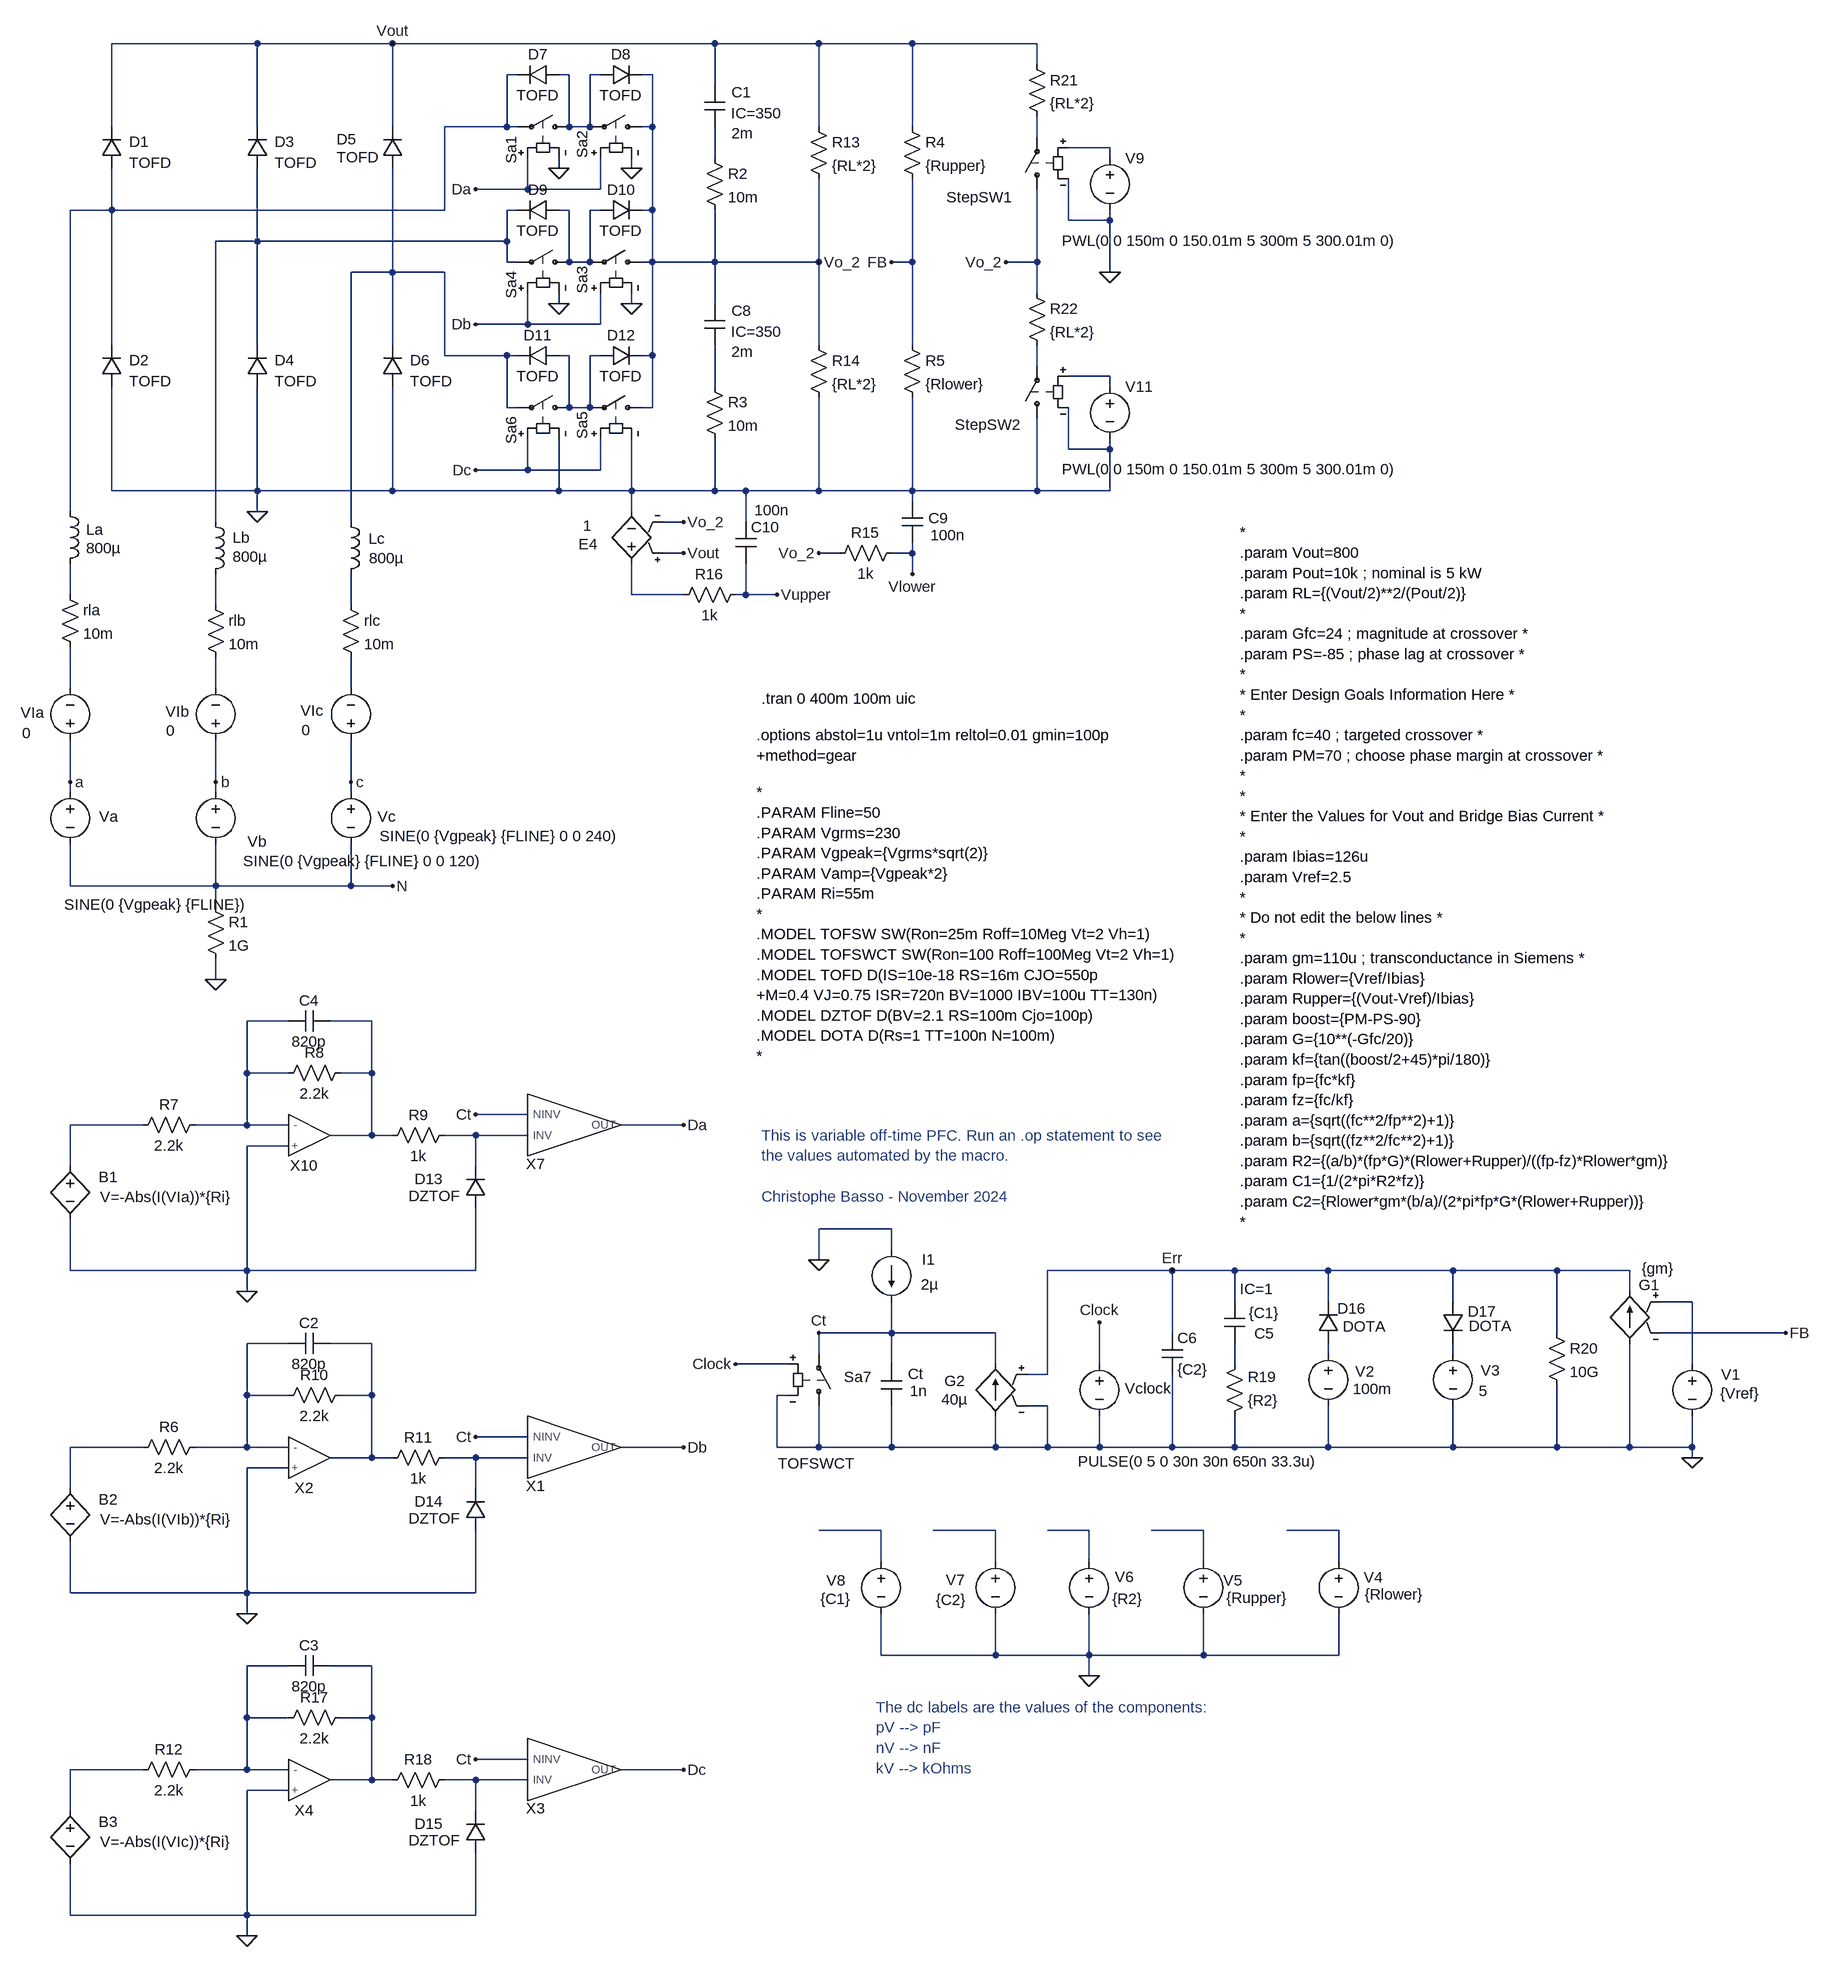
[diagram p0: schematic 3-phase Vienna PFC var Toff with switches - load step.asc]
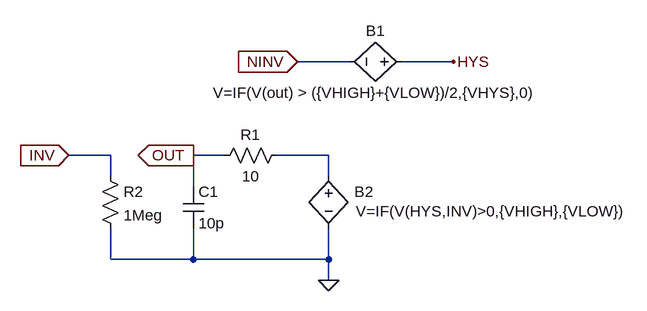
[diagram p1: sub-circuit comptof.asc]
3-phase Vienna PFC var Toff with switches - load step.asc, the LTspice schematic file:
Version 4
SHEET 1 4316 2068
WIRE 464 -960 240 -960
WIRE 672 -960 464 -960
WIRE 1168 -960 672 -960
WIRE 1328 -960 1168 -960
WIRE 1472 -960 1328 -960
WIRE 1664 -960 1472 -960
WIRE 1664 -928 1664 -960
WIRE 864 -912 848 -912
WIRE 944 -912 928 -912
WIRE 992 -912 976 -912
WIRE 1072 -912 1056 -912
WIRE 1168 -896 1168 -960
WIRE 240 -832 240 -960
WIRE 464 -832 464 -960
WIRE 672 -832 672 -960
WIRE 848 -832 848 -912
WIRE 848 -832 752 -832
WIRE 864 -832 848 -832
WIRE 944 -832 944 -912
WIRE 976 -832 976 -912
WIRE 976 -832 944 -832
WIRE 1072 -832 1072 -912
WIRE 1072 -832 1056 -832
WIRE 1328 -832 1328 -960
WIRE 1472 -832 1472 -960
WIRE 1664 -816 1664 -848
WIRE 1776 -800 1712 -800
WIRE 1168 -784 1168 -832
WIRE 1776 -784 1776 -800
WIRE 928 -768 928 -784
WIRE 1040 -768 1040 -784
WIRE 880 -736 880 -784
WIRE 880 -736 800 -736
WIRE 992 -736 992 -784
WIRE 992 -736 880 -736
WIRE 240 -704 240 -768
WIRE 240 -704 176 -704
WIRE 752 -704 752 -832
WIRE 752 -704 240 -704
WIRE 864 -704 848 -704
WIRE 944 -704 928 -704
WIRE 992 -704 976 -704
WIRE 1072 -704 1072 -832
WIRE 1072 -704 1056 -704
WIRE 1712 -688 1712 -752
WIRE 1776 -688 1776 -704
WIRE 1776 -688 1712 -688
WIRE 464 -656 464 -768
WIRE 464 -656 400 -656
WIRE 848 -656 848 -704
WIRE 848 -656 464 -656
WIRE 848 -624 848 -656
WIRE 864 -624 848 -624
WIRE 944 -624 944 -704
WIRE 976 -624 976 -704
WIRE 976 -624 944 -624
WIRE 1072 -624 1072 -704
WIRE 1072 -624 1056 -624
WIRE 1168 -624 1168 -704
WIRE 1168 -624 1072 -624
WIRE 1328 -624 1328 -752
WIRE 1328 -624 1168 -624
WIRE 1472 -624 1472 -752
WIRE 1472 -624 1440 -624
WIRE 1664 -624 1664 -736
WIRE 1664 -624 1616 -624
WIRE 672 -608 672 -768
WIRE 672 -608 608 -608
WIRE 752 -608 672 -608
WIRE 1776 -608 1776 -688
WIRE 1664 -576 1664 -624
WIRE 928 -560 928 -576
WIRE 1040 -560 1040 -576
WIRE 1168 -560 1168 -624
WIRE 880 -528 880 -576
WIRE 880 -528 800 -528
WIRE 992 -528 992 -576
WIRE 992 -528 880 -528
WIRE 240 -496 240 -704
WIRE 464 -496 464 -656
WIRE 672 -496 672 -608
WIRE 1328 -496 1328 -624
WIRE 1472 -496 1472 -624
WIRE 752 -480 752 -608
WIRE 848 -480 752 -480
WIRE 864 -480 848 -480
WIRE 944 -480 928 -480
WIRE 992 -480 976 -480
WIRE 1072 -480 1072 -624
WIRE 1072 -480 1056 -480
WIRE 1664 -464 1664 -496
WIRE 1776 -448 1712 -448
WIRE 1168 -432 1168 -496
WIRE 1776 -432 1776 -448
WIRE 848 -400 848 -480
WIRE 864 -400 848 -400
WIRE 944 -400 944 -480
WIRE 976 -400 976 -480
WIRE 976 -400 944 -400
WIRE 1072 -400 1072 -480
WIRE 1072 -400 1056 -400
WIRE 1712 -336 1712 -400
WIRE 1776 -336 1776 -352
WIRE 1776 -336 1712 -336
WIRE 880 -304 880 -352
WIRE 880 -304 800 -304
WIRE 992 -304 992 -352
WIRE 992 -304 880 -304
WIRE 240 -272 240 -432
WIRE 464 -272 464 -432
WIRE 464 -272 240 -272
WIRE 672 -272 672 -432
WIRE 672 -272 464 -272
WIRE 928 -272 928 -352
WIRE 928 -272 672 -272
WIRE 1040 -272 1040 -352
WIRE 1040 -272 928 -272
WIRE 1168 -272 1168 -352
WIRE 1168 -272 1040 -272
WIRE 1216 -272 1168 -272
WIRE 1328 -272 1328 -416
WIRE 1328 -272 1216 -272
WIRE 1472 -272 1472 -416
WIRE 1472 -272 1328 -272
WIRE 1664 -272 1664 -384
WIRE 1664 -272 1472 -272
WIRE 1776 -272 1776 -336
WIRE 1776 -272 1664 -272
WIRE 1472 -256 1472 -272
WIRE 176 -240 176 -704
WIRE 464 -240 464 -272
WIRE 1040 -240 1040 -272
WIRE 400 -224 400 -656
WIRE 608 -224 608 -608
WIRE 1120 -224 1088 -224
WIRE 1216 -224 1216 -272
WIRE 1120 -176 1088 -176
WIRE 1360 -176 1328 -176
WIRE 1472 -176 1472 -192
WIRE 1472 -176 1440 -176
WIRE 1472 -144 1472 -176
WIRE 176 -112 176 -160
WIRE 1040 -112 1040 -160
WIRE 1120 -112 1040 -112
WIRE 1216 -112 1216 -160
WIRE 1216 -112 1200 -112
WIRE 1264 -112 1216 -112
WIRE 400 -96 400 -144
WIRE 608 -96 608 -144
WIRE 176 32 176 -32
WIRE 400 32 400 -16
WIRE 608 32 608 -16
WIRE 176 176 176 112
WIRE 400 176 400 112
WIRE 608 176 608 112
WIRE 176 192 176 176
WIRE 400 192 400 176
WIRE 608 192 608 176
WIRE 176 336 176 272
WIRE 400 336 400 272
WIRE 400 336 176 336
WIRE 608 336 608 272
WIRE 608 336 400 336
WIRE 672 336 608 336
WIRE 400 368 400 336
WIRE 400 480 400 448
WIRE 512 544 448 544
WIRE 640 544 576 544
WIRE 448 624 448 544
WIRE 512 624 448 624
WIRE 640 624 640 544
WIRE 640 624 592 624
WIRE 880 688 800 688
WIRE 288 704 176 704
WIRE 448 704 448 624
WIRE 448 704 368 704
WIRE 512 704 448 704
WIRE 1120 704 1024 704
WIRE 640 720 640 624
WIRE 640 720 576 720
WIRE 672 720 640 720
WIRE 800 720 752 720
WIRE 880 720 800 720
WIRE 512 736 448 736
WIRE 176 768 176 704
WIRE 800 768 800 720
WIRE 1440 864 1328 864
WIRE 1440 896 1440 864
WIRE 1328 912 1328 864
WIRE 176 928 176 848
WIRE 448 928 448 736
WIRE 448 928 176 928
WIRE 800 928 800 832
WIRE 800 928 448 928
WIRE 1872 928 1680 928
WIRE 1968 928 1872 928
WIRE 2112 928 1968 928
WIRE 2304 928 2112 928
WIRE 2464 928 2304 928
WIRE 2576 928 2464 928
WIRE 448 960 448 928
WIRE 2576 960 2576 928
WIRE 1968 976 1968 928
WIRE 2112 976 2112 928
WIRE 2304 976 2304 928
WIRE 2672 976 2624 976
WIRE 1440 1024 1440 976
WIRE 1440 1024 1328 1024
WIRE 1600 1024 1440 1024
WIRE 1872 1024 1872 928
WIRE 2464 1024 2464 928
WIRE 2816 1024 2624 1024
WIRE 512 1040 448 1040
WIRE 640 1040 576 1040
WIRE 1328 1056 1328 1024
WIRE 2112 1056 2112 1040
WIRE 2304 1056 2304 1040
WIRE 1280 1072 1200 1072
WIRE 1440 1072 1440 1024
WIRE 1600 1072 1600 1024
WIRE 1760 1072 1760 1008
WIRE 1968 1072 1968 1040
WIRE 2672 1072 2672 976
WIRE 1680 1088 1680 928
WIRE 1680 1088 1648 1088
WIRE 448 1120 448 1040
WIRE 512 1120 448 1120
WIRE 640 1120 640 1040
WIRE 640 1120 592 1120
WIRE 1280 1120 1264 1120
WIRE 1680 1136 1648 1136
WIRE 880 1184 800 1184
WIRE 288 1200 176 1200
WIRE 448 1200 448 1120
WIRE 448 1200 368 1200
WIRE 512 1200 448 1200
WIRE 1120 1200 1024 1200
WIRE 1264 1200 1264 1120
WIRE 1328 1200 1328 1136
WIRE 1328 1200 1264 1200
WIRE 1440 1200 1440 1136
WIRE 1440 1200 1328 1200
WIRE 1600 1200 1600 1152
WIRE 1600 1200 1440 1200
WIRE 1680 1200 1680 1136
WIRE 1680 1200 1600 1200
WIRE 1760 1200 1760 1152
WIRE 1760 1200 1680 1200
WIRE 1872 1200 1872 1088
WIRE 1872 1200 1760 1200
WIRE 1968 1200 1968 1152
WIRE 1968 1200 1872 1200
WIRE 2112 1200 2112 1136
WIRE 2112 1200 1968 1200
WIRE 2304 1200 2304 1136
WIRE 2304 1200 2112 1200
WIRE 2464 1200 2464 1104
WIRE 2464 1200 2304 1200
WIRE 2576 1200 2576 1040
WIRE 2576 1200 2464 1200
WIRE 2672 1200 2672 1152
WIRE 2672 1200 2576 1200
WIRE 640 1216 640 1120
WIRE 640 1216 576 1216
WIRE 672 1216 640 1216
WIRE 800 1216 752 1216
WIRE 880 1216 800 1216
WIRE 2672 1216 2672 1200
WIRE 512 1232 448 1232
WIRE 176 1264 176 1200
WIRE 800 1264 800 1216
WIRE 1424 1328 1328 1328
WIRE 1600 1328 1504 1328
WIRE 1744 1328 1680 1328
WIRE 1920 1328 1840 1328
WIRE 2128 1328 2048 1328
WIRE 1424 1376 1424 1328
WIRE 1600 1376 1600 1328
WIRE 1744 1376 1744 1328
WIRE 1920 1376 1920 1328
WIRE 2128 1376 2128 1328
WIRE 176 1424 176 1344
WIRE 448 1424 448 1232
WIRE 448 1424 176 1424
WIRE 800 1424 800 1328
WIRE 800 1424 448 1424
WIRE 448 1456 448 1424
WIRE 1424 1520 1424 1456
WIRE 1600 1520 1600 1456
WIRE 1600 1520 1424 1520
WIRE 1744 1520 1744 1456
WIRE 1744 1520 1600 1520
WIRE 1920 1520 1920 1456
WIRE 1920 1520 1744 1520
WIRE 2128 1520 2128 1456
WIRE 2128 1520 1920 1520
WIRE 512 1536 448 1536
WIRE 640 1536 576 1536
WIRE 1744 1552 1744 1520
WIRE 448 1616 448 1536
WIRE 512 1616 448 1616
WIRE 640 1616 640 1536
WIRE 640 1616 592 1616
WIRE 880 1680 800 1680
WIRE 288 1696 176 1696
WIRE 448 1696 448 1616
WIRE 448 1696 368 1696
WIRE 512 1696 448 1696
WIRE 1120 1696 1024 1696
WIRE 640 1712 640 1616
WIRE 640 1712 576 1712
WIRE 672 1712 640 1712
WIRE 800 1712 752 1712
WIRE 880 1712 800 1712
WIRE 512 1728 448 1728
WIRE 176 1760 176 1696
WIRE 800 1760 800 1712
WIRE 176 1920 176 1840
WIRE 448 1920 448 1728
WIRE 448 1920 176 1920
WIRE 800 1920 800 1824
WIRE 800 1920 448 1920
WIRE 448 1952 448 1920
FLAG 400 480 0
FLAG 176 176 a
FLAG 400 176 b
FLAG 608 176 c
FLAG 1440 -624 FB
FLAG 672 -960 Vout
FLAG 672 336 N
FLAG 464 -240 0
FLAG 928 -768 0
FLAG 1040 -768 0
FLAG 1040 -560 0
FLAG 928 -560 0
FLAG 800 -304 Dc
FLAG 800 -528 Db
FLAG 800 -736 Da
FLAG 1328 -624 Vo_2
FLAG 1328 -176 Vo_2
FLAG 1472 -144 Vlower
FLAG 1120 -224 Vo_2
FLAG 1120 -176 Vout
FLAG 1264 -112 Vupper
FLAG 448 960 0
FLAG 800 688 Ct
FLAG 1120 704 Da
FLAG 448 1456 0
FLAG 800 1184 Ct
FLAG 1120 1200 Db
FLAG 448 1952 0
FLAG 800 1680 Ct
FLAG 1120 1696 Dc
FLAG 1328 912 0
FLAG 2672 1216 0
FLAG 1872 928 Err
FLAG 2816 1024 FB
FLAG 1200 1072 Clock
FLAG 1760 1008 Clock
FLAG 1744 1552 0
FLAG 1328 1024 Ct
FLAG 1616 -624 Vo_2
FLAG 1776 -608 0
DATAFLAG 1344 1328 ""
DATAFLAG 1536 1328 ""
DATAFLAG 1712 1328 ""
DATAFLAG 1856 1328 ""
DATAFLAG 2080 1328 ""
SYMBOL voltage 176 176 R0
WINDOW 0 45 53 Left 2
WINDOW 3 -9 189 Left 2
WINDOW 123 0 0 Left 0
WINDOW 39 0 0 Left 0
SYMATTR InstName Va
SYMATTR Value SINE(0 {Vgpeak} {FLINE})
SYMBOL voltage 400 176 R0
WINDOW 0 49 92 Left 2
WINDOW 3 42 122 Left 2
WINDOW 123 0 0 Left 0
WINDOW 39 0 0 Left 0
SYMATTR InstName Vb
SYMATTR Value SINE(0 {Vgpeak} {FLINE} 0 0 120)
SYMBOL voltage 608 176 R0
WINDOW 0 41 53 Left 2
WINDOW 3 44 83 Left 2
WINDOW 123 0 0 Left 0
WINDOW 39 0 0 Left 0
SYMATTR InstName Vc
SYMATTR Value SINE(0 {Vgpeak} {FLINE} 0 0 240)
SYMBOL res 384 352 R0
SYMATTR InstName R1
SYMATTR Value 1G
SYMBOL res 160 -128 R0
SYMATTR InstName rla
SYMATTR Value 10m
SYMBOL res 384 -112 R0
SYMATTR InstName rlb
SYMATTR Value 10m
SYMBOL res 592 -112 R0
SYMATTR InstName rlc
SYMATTR Value 10m
SYMBOL ind 160 -256 R0
WINDOW 0 41 44 Left 2
WINDOW 3 41 72 Left 2
SYMATTR InstName La
SYMATTR Value 800µ
SYMBOL ind 384 -240 R0
WINDOW 0 42 40 Left 2
WINDOW 3 42 69 Left 2
SYMATTR InstName Lb
SYMATTR Value 800µ
SYMBOL ind 592 -240 R0
WINDOW 0 43 42 Left 2
WINDOW 3 44 72 Left 2
SYMATTR InstName Lc
SYMATTR Value 800µ
SYMBOL voltage 176 128 R180
WINDOW 0 40 59 Left 2
WINDOW 3 60 27 Left 2
WINDOW 123 0 0 Left 0
WINDOW 39 0 0 Left 0
SYMATTR InstName VIa
SYMATTR Value 0
SYMBOL voltage 400 128 R180
WINDOW 0 41 60 Left 2
WINDOW 3 63 31 Left 2
WINDOW 123 0 0 Left 0
WINDOW 39 0 0 Left 0
SYMATTR InstName VIb
SYMATTR Value 0
SYMBOL voltage 608 128 R180
WINDOW 0 43 62 Left 2
WINDOW 3 62 32 Left 2
WINDOW 123 0 0 Left 0
WINDOW 39 0 0 Left 0
SYMATTR InstName VIc
SYMATTR Value 0
SYMBOL sw 1072 -832 M270
WINDOW 3 47 44 Invisible 2
WINDOW 0 -49 108 Left 2
SYMATTR Value TOFSW
SYMATTR InstName Sa2
SYMBOL sw 960 -832 M270
WINDOW 3 41 43 Invisible 2
WINDOW 0 -57 105 Left 2
SYMATTR Value TOFSW
SYMATTR InstName Sa1
SYMBOL cap 1152 -896 R0
WINDOW 0 42 11 Left 2
WINDOW 3 42 74 Left 2
WINDOW 123 41 43 Left 2
SYMATTR InstName C1
SYMATTR Value 2m
SYMATTR Value2 IC=350
SYMBOL res 1152 -800 R0
SYMATTR InstName R2
SYMATTR Value 10m
SYMBOL res 1456 -848 R0
SYMATTR InstName R4
SYMATTR Value {Rupper}
SYMBOL res 1456 -512 R0
SYMATTR InstName R5
SYMATTR Value {Rlower}
SYMBOL COMPTOF 944 704 M180
WINDOW 0 -52 -44 Bottom 2
SYMATTR InstName X7
SYMATTR SpiceLine VHIGH=5 VLOW=100m VHYS=10m
SYMBOL opampTOF 576 704 R0
WINDOW 0 -40 78 Bottom 2
SYMATTR InstName X10
SYMATTR SpiceLine VHIGH=5 VLOW=100m
SYMBOL res 1312 -848 R0
SYMATTR InstName R13
SYMATTR Value {RL*2}
SYMBOL diode 224 -768 M180
WINDOW 0 43 41 Left 2
WINDOW 3 43 9 Left 2
SYMATTR InstName D1
SYMATTR Value TOFD
SYMBOL diode 224 -432 M180
WINDOW 0 43 41 Left 2
WINDOW 3 43 9 Left 2
SYMATTR InstName D2
SYMATTR Value TOFD
SYMBOL diode 448 -768 M180
WINDOW 0 43 41 Left 2
WINDOW 3 43 9 Left 2
SYMATTR InstName D3
SYMATTR Value TOFD
SYMBOL diode 448 -432 M180
WINDOW 0 43 41 Left 2
WINDOW 3 43 9 Left 2
SYMATTR InstName D4
SYMATTR Value TOFD
SYMBOL diode 656 -768 M180
WINDOW 0 -70 45 Left 2
WINDOW 3 -70 17 Left 2
SYMATTR InstName D5
SYMATTR Value TOFD
SYMBOL diode 656 -432 M180
WINDOW 0 43 41 Left 2
WINDOW 3 43 9 Left 2
SYMATTR InstName D6
SYMATTR Value TOFD
SYMBOL diode 928 -896 M270
WINDOW 0 32 32 VTop 2
WINDOW 3 0 32 VBottom 2
SYMATTR InstName D7
SYMATTR Value TOFD
SYMBOL diode 992 -928 M90
WINDOW 0 0 32 VBottom 2
WINDOW 3 32 32 VTop 2
SYMATTR InstName D8
SYMATTR Value TOFD
SYMBOL sw 1072 -624 M270
WINDOW 3 47 44 Invisible 2
WINDOW 0 -49 108 Left 2
SYMATTR Value TOFSW
SYMATTR InstName Sa3
SYMBOL sw 960 -624 M270
WINDOW 3 41 43 Invisible 2
WINDOW 0 -57 105 Left 2
SYMATTR Value TOFSW
SYMATTR InstName Sa4
SYMBOL diode 928 -688 M270
WINDOW 0 32 32 VTop 2
WINDOW 3 0 32 VBottom 2
SYMATTR InstName D9
SYMATTR Value TOFD
SYMBOL diode 992 -720 M90
WINDOW 0 0 32 VBottom 2
WINDOW 3 32 32 VTop 2
SYMATTR InstName D10
SYMATTR Value TOFD
SYMBOL sw 1072 -400 M270
WINDOW 3 47 44 Invisible 2
WINDOW 0 -49 108 Left 2
SYMATTR Value TOFSW
SYMATTR InstName Sa5
SYMBOL sw 960 -400 M270
WINDOW 3 41 43 Invisible 2
WINDOW 0 -57 105 Left 2
SYMATTR Value TOFSW
SYMATTR InstName Sa6
SYMBOL diode 928 -464 M270
WINDOW 0 32 32 VTop 2
WINDOW 3 0 32 VBottom 2
SYMATTR InstName D11
SYMATTR Value TOFD
SYMBOL diode 992 -496 M90
WINDOW 0 0 32 VBottom 2
WINDOW 3 32 32 VTop 2
SYMATTR InstName D12
SYMATTR Value TOFD
SYMBOL cap 1152 -560 R0
WINDOW 0 42 11 Left 2
WINDOW 3 42 74 Left 2
WINDOW 123 41 43 Left 2
SYMATTR InstName C8
SYMATTR Value 2m
SYMATTR Value2 IC=350
SYMBOL res 1152 -448 R0
SYMATTR InstName R3
SYMATTR Value 10m
SYMBOL res 1312 -512 R0
SYMATTR InstName R14
SYMATTR Value {RL*2}
SYMBOL e 1040 -144 R180
WINDOW 0 52 46 Left 2
WINDOW 3 61 74 Left 2
SYMATTR InstName E4
SYMATTR Value 1
SYMBOL res 1456 -192 R90
WINDOW 0 0 56 VBottom 2
WINDOW 3 32 56 VTop 2
SYMATTR InstName R15
SYMATTR Value 1k
SYMBOL cap 1456 -256 R0
WINDOW 0 41 26 Left 2
WINDOW 3 44 52 Left 2
SYMATTR InstName C9
SYMATTR Value 100n
SYMBOL res 1216 -128 R90
WINDOW 0 0 56 VBottom 2
WINDOW 3 32 56 VTop 2
SYMATTR InstName R16
SYMATTR Value 1k
SYMBOL cap 1200 -224 R0
WINDOW 3 29 -18 Left 2
SYMATTR Value 100n
SYMATTR InstName C10
SYMBOL bv 176 752 R0
WINDOW 0 44 32 Left 2
WINDOW 3 46 63 Left 2
SYMATTR InstName B1
SYMATTR Value V=-Abs(I(VIa))*{Ri}
SYMBOL res 384 688 R90
WINDOW 0 0 56 VBottom 2
WINDOW 3 32 56 VTop 2
SYMATTR InstName R7
SYMATTR Value 2.2k
SYMBOL res 608 608 R90
WINDOW 0 0 56 VBottom 2
WINDOW 3 32 56 VTop 2
SYMATTR InstName R8
SYMATTR Value 2.2k
SYMBOL cap 576 528 R90
WINDOW 0 0 32 VBottom 2
WINDOW 3 32 32 VTop 2
SYMATTR InstName C4
SYMATTR Value 820p
SYMBOL res 768 704 R90
WINDOW 0 0 56 VBottom 2
WINDOW 3 32 56 VTop 2
SYMATTR InstName R9
SYMATTR Value 1k
SYMBOL diode 816 832 R180
WINDOW 0 66 45 Left 2
WINDOW 3 38 19 Left 2
SYMATTR InstName D13
SYMATTR Value DZTOF
SYMBOL COMPTOF 944 1200 M180
WINDOW 0 -52 -44 Bottom 2
SYMATTR InstName X1
SYMATTR SpiceLine VHIGH=5 VLOW=100m VHYS=10m
SYMBOL opampTOF 576 1200 R0
WINDOW 0 -40 78 Bottom 2
SYMATTR InstName X2
SYMATTR SpiceLine VHIGH=5 VLOW=100m
SYMBOL bv 176 1248 R0
WINDOW 0 44 32 Left 2
WINDOW 3 46 63 Left 2
SYMATTR InstName B2
SYMATTR Value V=-Abs(I(VIb))*{Ri}
SYMBOL res 384 1184 R90
WINDOW 0 0 56 VBottom 2
WINDOW 3 32 56 VTop 2
SYMATTR InstName R6
SYMATTR Value 2.2k
SYMBOL res 608 1104 R90
WINDOW 0 0 56 VBottom 2
WINDOW 3 32 56 VTop 2
SYMATTR InstName R10
SYMATTR Value 2.2k
SYMBOL cap 576 1024 R90
WINDOW 0 0 32 VBottom 2
WINDOW 3 32 32 VTop 2
SYMATTR InstName C2
SYMATTR Value 820p
SYMBOL res 768 1200 R90
WINDOW 0 0 56 VBottom 2
WINDOW 3 32 56 VTop 2
SYMATTR InstName R11
SYMATTR Value 1k
SYMBOL diode 816 1328 R180
WINDOW 0 66 45 Left 2
WINDOW 3 38 19 Left 2
SYMATTR InstName D14
SYMATTR Value DZTOF
SYMBOL COMPTOF 944 1696 M180
WINDOW 0 -52 -44 Bottom 2
SYMATTR InstName X3
SYMATTR SpiceLine VHIGH=5 VLOW=100m VHYS=10m
SYMBOL opampTOF 576 1696 R0
WINDOW 0 -40 78 Bottom 2
SYMATTR InstName X4
SYMATTR SpiceLine VHIGH=5 VLOW=100m
SYMBOL bv 176 1744 R0
WINDOW 0 44 32 Left 2
WINDOW 3 46 63 Left 2
SYMATTR InstName B3
SYMATTR Value V=-Abs(I(VIc))*{Ri}
SYMBOL res 384 1680 R90
WINDOW 0 0 56 VBottom 2
WINDOW 3 32 56 VTop 2
SYMATTR InstName R12
SYMATTR Value 2.2k
SYMBOL res 608 1600 R90
WINDOW 0 0 56 VBottom 2
WINDOW 3 32 56 VTop 2
SYMATTR InstName R17
SYMATTR Value 2.2k
SYMBOL cap 576 1520 R90
WINDOW 0 0 32 VBottom 2
WINDOW 3 32 32 VTop 2
SYMATTR InstName C3
SYMATTR Value 820p
SYMBOL res 768 1696 R90
WINDOW 0 0 56 VBottom 2
WINDOW 3 32 56 VTop 2
SYMATTR InstName R18
SYMATTR Value 1k
SYMBOL diode 816 1824 R180
WINDOW 0 66 45 Left 2
WINDOW 3 38 19 Left 2
SYMATTR InstName D15
SYMATTR Value DZTOF
SYMBOL current 1440 896 R0
WINDOW 0 47 15 Left 2
WINDOW 3 45 53 Left 2
SYMATTR InstName I1
SYMATTR Value 2µ
SYMBOL cap 1424 1072 R0
WINDOW 0 41 15 Left 2
WINDOW 3 44 41 Left 2
SYMATTR InstName Ct
SYMATTR Value 1n
SYMBOL sw 1328 1152 M180
WINDOW 3 -63 -73 Left 2
WINDOW 0 39 60 Left 2
SYMATTR Value TOFSWCT
SYMATTR InstName Sa7
SYMBOL voltage 2672 1056 R0
WINDOW 0 45 32 Left 2
WINDOW 3 43 61 Left 2
WINDOW 123 0 0 Left 0
WINDOW 39 0 0 Left 0
SYMATTR InstName V1
SYMATTR Value {Vref}
SYMBOL cap 1952 976 R0
WINDOW 0 46 49 Left 2
WINDOW 3 38 17 Left 2
WINDOW 123 24 -20 Left 2
SYMATTR InstName C5
SYMATTR Value {C1}
SYMATTR Value2 IC=1
SYMBOL res 1952 1168 M180
WINDOW 0 36 76 Left 2
WINDOW 3 36 40 Left 2
SYMATTR InstName R19
SYMATTR Value {R2}
SYMBOL cap 1856 1088 M180
WINDOW 0 24 56 Left 2
WINDOW 3 24 8 Left 2
SYMATTR InstName C6
SYMATTR Value {C2}
SYMBOL g 2576 944 M0
WINDOW 0 -46 6 Left 2
WINDOW 3 -69 -19 Left 2
SYMATTR InstName G1
SYMATTR Value {gm}
SYMBOL res 2448 1008 R0
SYMATTR InstName R20
SYMATTR Value 10G
SYMBOL voltage 2112 1040 R0
WINDOW 0 42 43 Left 2
WINDOW 3 38 70 Left 2
WINDOW 123 0 0 Left 0
WINDOW 39 0 0 Left 0
SYMATTR InstName V2
SYMATTR Value 100m
SYMBOL voltage 2304 1040 R0
WINDOW 0 43 42 Left 2
WINDOW 3 40 73 Left 2
SYMATTR InstName V3
SYMATTR Value 5
SYMBOL diode 2128 1040 R180
WINDOW 0 -42 54 Left 2
WINDOW 3 -73 26 Left 2
SYMATTR InstName D16
SYMATTR Value DOTA
SYMBOL diode 2288 976 R0
WINDOW 0 39 15 Left 2
WINDOW 3 40 37 Left 2
SYMATTR InstName D17
SYMATTR Value DOTA
SYMBOL g 1600 1056 M0
WINDOW 0 46 42 Left 2
WINDOW 3 43 70 Left 2
SYMATTR InstName G2
SYMATTR Value 40µ
SYMBOL voltage 1760 1056 R0
WINDOW 0 39 53 Left 2
WINDOW 3 -33 166 Left 2
WINDOW 123 0 0 Left 0
WINDOW 39 0 0 Left 0
SYMATTR InstName Vclock
SYMATTR Value PULSE(0 5 0 30n 30n 650n 33.3u)
SYMBOL voltage 2128 1360 R0
WINDOW 0 39 40 Left 2
WINDOW 3 40 66 Left 2
WINDOW 123 0 0 Left 0
WINDOW 39 0 0 Left 0
SYMATTR InstName V4
SYMATTR Value {Rlower}
SYMBOL voltage 1920 1360 R0
WINDOW 0 31 45 Left 2
WINDOW 3 35 72 Left 2
WINDOW 123 0 0 Left 0
WINDOW 39 0 0 Left 0
SYMATTR InstName V5
SYMATTR Value {Rupper}
SYMBOL voltage 1744 1360 R0
WINDOW 0 40 39 Left 2
WINDOW 3 36 73 Left 2
WINDOW 123 0 0 Left 0
WINDOW 39 0 0 Left 0
SYMATTR InstName V6
SYMATTR Value {R2}
SYMBOL voltage 1600 1360 R0
WINDOW 0 -76 44 Left 2
WINDOW 3 -92 75 Left 2
SYMATTR InstName V7
SYMATTR Value {C2}
SYMBOL voltage 1424 1360 R0
WINDOW 0 -84 45 Left 2
WINDOW 3 -93 73 Left 2
WINDOW 123 0 0 Left 0
WINDOW 39 0 0 Left 0
SYMATTR InstName V8
SYMATTR Value {C1}
SYMBOL sw 1664 -720 R180
WINDOW 3 47 44 Invisible 2
WINDOW 0 38 4 Left 2
SYMATTR Value TOFSW
SYMATTR InstName StepSW1
SYMBOL res 1648 -944 R0
SYMATTR InstName R21
SYMATTR Value {RL*2}
SYMBOL voltage 1776 -800 R0
WINDOW 3 -74 143 Left 2
WINDOW 123 0 0 Left 0
WINDOW 39 0 0 Left 0
SYMATTR Value PWL(0 0 150m 0 150.01m 5 300m 5 300.01m 0)
SYMATTR InstName V9
SYMBOL sw 1664 -368 R180
WINDOW 3 47 44 Invisible 2
WINDOW 0 25 6 Left 2
SYMATTR Value TOFSW
SYMATTR InstName StepSW2
SYMBOL res 1648 -592 R0
SYMATTR InstName R22
SYMATTR Value {RL*2}
SYMBOL voltage 1776 -448 R0
WINDOW 3 -74 143 Left 2
WINDOW 123 0 0 Left 0
WINDOW 39 0 0 Left 0
SYMATTR Value PWL(0 0 150m 0 150.01m 5 300m 5 300.01m 0)
SYMATTR InstName V11
TEXT 1232 192 Left 2 !*\n.PARAM Fline=50\n.PARAM Vgrms=230\n.PARAM Vgpeak={Vgrms*sqrt(2)}\n.PARAM Vamp={Vgpeak*2}\n.PARAM Ri=55m\n*\n.MODEL TOFSW SW(Ron=25m Roff=10Meg Vt=2 Vh=1)\n.MODEL TOFSWCT SW(Ron=100 Roff=100Meg Vt=2 Vh=1)\n.MODEL TOFD D(IS=10e-18 RS=16m CJO=550p \n+M=0.4 VJ=0.75 ISR=720n BV=1000 IBV=100u TT=130n)\n.MODEL DZTOF D(BV=2.1 RS=100m Cjo=100p)\n.MODEL DOTA D(Rs=1 TT=100n N=100m)\n*
TEXT 1240 48 Left 2 !.tran 0 400m 100m uic
TEXT 1232 104 Left 2 !.options abstol=1u vntol=1m reltol=0.01 gmin=100p\n+method=gear
TEXT 1976 -208 Left 2 !*\n.param Vout=800\n.param Pout=10k ; nominal is 5 kW\n.param RL={(Vout/2)**2/(Pout/2)}\n*\n.param Gfc=24 ; magnitude at crossover *\n.param PS=-85 ; phase lag at crossover *\n*\n* Enter Design Goals Information Here *\n*\n.param fc=40 ; targeted crossover *\n.param PM=70 ; choose phase margin at crossover *\n*\n*\n* Enter the Values for Vout and Bridge Bias Current *\n*\n.param Ibias=126u\n.param Vref=2.5\n*\n* Do not edit the below lines *\n*\n.param gm=110u ; transconductance in Siemens *\n.param Rlower={Vref/Ibias}\n.param Rupper={(Vout-Vref)/Ibias}\n.param boost={PM-PS-90}\n.param G={10**(-Gfc/20)}\n.param kf={tan((boost/2+45)*pi/180)}\n.param fp={fc*kf}\n.param fz={fc/kf}\n.param a={sqrt((fc**2/fp**2)+1)}\n.param b={sqrt((fz**2/fc**2)+1)}\n.param R2={(a/b)*(fp*G)*(Rlower+Rupper)/((fp-fz)*Rlower*gm)}\n.param C1={1/(2*pi*R2*fz)}\n.param C2={Rlower*gm*(b/a)/(2*pi*fp*G*(Rlower+Rupper))}\n*
TEXT 1416 1600 Left 2 ;The dc labels are the values of the components:\npV --> pF\nnV --> nF\nkV --> kOhms
TEXT 1240 720 Left 2 ;This is variable off-time PFC. Run an .op statement to see\nthe values automated by the macro.\n \nChristophe Basso - November 2024

comptof.asc, the sub-circuit schematic file:
Version 4
SHEET 1 880 680
WIRE 64 192 -16 192
WIRE 224 192 144 192
WIRE -304 336 -368 336
WIRE -128 336 -176 336
WIRE 32 336 -48 336
WIRE -304 368 -304 336
WIRE 32 368 32 336
WIRE -176 384 -176 336
WIRE -304 496 -304 448
WIRE -176 496 -176 448
WIRE -176 496 -304 496
WIRE 32 496 32 448
WIRE 32 496 -176 496
WIRE 32 528 32 496
FLAG -16 192 NINV
IOPIN -16 192 In
FLAG 224 192 HYS
FLAG 32 528 0
FLAG -176 336 OUT
IOPIN -176 336 Out
FLAG -368 336 INV
IOPIN -368 336 In
SYMBOL bv 160 192 R90
WINDOW 0 -32 56 VBottom 2
WINDOW 3 32 56 VTop 2
SYMATTR InstName B1
SYMATTR Value V=IF(V(out) > ({VHIGH}+{VLOW})/2,{VHYS},0)
SYMBOL bv 32 352 R0
WINDOW 0 40 40 Left 2
WINDOW 3 42 70 Left 2
SYMATTR InstName B2
SYMATTR Value V=IF(V(HYS,INV)>0,{VHIGH},{VLOW})
SYMBOL res -32 320 R90
WINDOW 0 0 56 VBottom 2
WINDOW 3 32 56 VTop 2
SYMATTR InstName R1
SYMATTR Value 10
SYMBOL cap -192 384 R0
SYMATTR InstName C1
SYMATTR Value 10p
SYMBOL res -320 352 R0
SYMATTR InstName R2
SYMATTR Value 1Meg

The netlist it stands for:
* 3-phase Vienna PFC var Toff with switches - load step.asc
Va a N SINE(0 {Vgpeak} {FLINE})
Vb b N SINE(0 {Vgpeak} {FLINE} 0 0 120)
Vc c N SINE(0 {Vgpeak} {FLINE} 0 0 240)
R1 N 0 1G
rla N013 N017 10m
rlb N015 N018 10m
rlc N016 N019 10m
La N001 N013 800µ
Lb N006 N015 800µ
Lc N008 N016 800µ
VIa a N017 0
VIb b N018 0
VIc c N019 0
Sa2 Vo_2 N002 Da 0 TOFSW
Sa1 N002 N001 Da 0 TOFSW
C1 Vout N005 2m IC=350
R2 N005 Vo_2 10m
R4 Vout FB {Rupper}
R5 FB 0 {Rlower}
XX7 N023 Ct Da comptof params: VHIGH=5 VLOW=100m VHYS=10m
XX10 N020 0 N021 opampTOF params: VHIGH=5 VLOW=100m  ; pins - + OUT
R13 Vout Vo_2 {RL*2}
D1 N001 Vout TOFD
D2 0 N001 TOFD
D3 N006 Vout TOFD
D4 0 N006 TOFD
D5 N008 Vout TOFD
D6 0 N008 TOFD
D7 N002 N001 TOFD
D8 N002 Vo_2 TOFD
Sa3 Vo_2 N007 Db 0 TOFSW
Sa4 N007 N006 Db 0 TOFSW
D9 N007 N006 TOFD
D10 N007 Vo_2 TOFD
Sa5 Vo_2 N009 Dc 0 TOFSW
Sa6 N009 N008 Dc 0 TOFSW
D11 N009 N008 TOFD
D12 N009 Vo_2 TOFD
C8 Vo_2 N012 2m IC=350
R3 N012 0 10m
R14 Vo_2 0 {RL*2}
E4 N014 0 Vout Vo_2 1
R15 Vlower Vo_2 1k
C9 0 Vlower 100n
R16 Vupper N014 1k
C10 0 Vupper 100n
B1 N022 0 V=-Abs(I(VIa))*{Ri}
R7 N020 N022 2.2k
R8 N021 N020 2.2k
C4 N021 N020 820p
R9 N023 N021 1k
D13 0 N023 DZTOF
XX1 N031 Ct Db comptof params: VHIGH=5 VLOW=100m VHYS=10m
XX2 N025 0 N026 opampTOF params: VHIGH=5 VLOW=100m  ; pins - + OUT
B2 N030 0 V=-Abs(I(VIb))*{Ri}
R6 N025 N030 2.2k
R10 N026 N025 2.2k
C2 N026 N025 820p
R11 N031 N026 1k
D14 0 N031 DZTOF
XX3 N040 Ct Dc comptof params: VHIGH=5 VLOW=100m VHYS=10m
XX4 N037 0 N038 opampTOF params: VHIGH=5 VLOW=100m  ; pins - + OUT
B3 N039 0 V=-Abs(I(VIc))*{Ri}
R12 N037 N039 2.2k
R17 N038 N037 2.2k
C3 N038 N037 820p
R18 N040 N038 1k
D15 0 N040 DZTOF
I1 0 Ct 2µ
Ct Ct 0 1n
Sa7 0 Ct Clock 0 TOFSWCT
V1 N024 0 {Vref}
C5 Err N029 {C1} IC=1
R19 0 N029 {R2}
C6 0 Err {C2}
G1 0 Err N024 FB {gm}
R20 Err 0 10G
V2 N027 0 100m
V3 N028 0 5
D16 N027 Err DOTA
D17 Err N028 DOTA
G2 0 Ct Err 0 40µ
Vclock Clock 0 PULSE(0 5 0 30n 30n 650n 33.3u)
V4 N036 0 {Rlower}
V5 N035 0 {Rupper}
V6 N034 0 {R2}
V7 N033 0 {C2}
V8 N032 0 {C1}
StepSW1 Vo_2 N003 N004 0 TOFSW
R21 Vout N003 {RL*2}
V9 N004 0 PWL(0 0 150m 0 150.01m 5 300m 5 300.01m 0)
StepSW2 0 N010 N011 0 TOFSW
R22 Vo_2 N010 {RL*2}
V11 N011 0 PWL(0 0 150m 0 150.01m 5 300m 5 300.01m 0)

* block symbol definitions
.subckt comptof INV NINV OUT
B1 HYS NINV V=IF(V(out) > ({VHIGH}+{VLOW})/2,{VHYS},0)
B2 N001 0 V=IF(V(HYS,INV)>0,{VHIGH},{VLOW})
R1 N001 OUT 10
C1 OUT 0 10p
R2 INV 0 1Meg
.ends comptof

.model D D
.lib standard.dio
*
.PARAM Fline=50
.PARAM Vgrms=230
.PARAM Vgpeak={Vgrms*sqrt(2)}
.PARAM Vamp={Vgpeak*2}
.PARAM Ri=55m
*
.MODEL TOFSW SW(Ron=25m Roff=10Meg Vt=2 Vh=1)
.MODEL TOFSWCT SW(Ron=100 Roff=100Meg Vt=2 Vh=1)
.MODEL TOFD D(IS=10e-18 RS=16m CJO=550p
+M=0.4 VJ=0.75 ISR=720n BV=1000 IBV=100u TT=130n)
.MODEL DZTOF D(BV=2.1 RS=100m Cjo=100p)
.MODEL DOTA D(Rs=1 TT=100n N=100m)
*
.tran 0 400m 100m uic
.options abstol=1u vntol=1m reltol=0.01 gmin=100p
+method=gear
*
.param Vout=800
.param Pout=10k ; nominal is 5 kW
.param RL={(Vout/2)**2/(Pout/2)}
*
.param Gfc=24 ; magnitude at crossover *
.param PS=-85 ; phase lag at crossover *
*
* Enter Design Goals Information Here *
*
.param fc=40 ; targeted crossover *
.param PM=70 ; choose phase margin at crossover *
*
*
* Enter the Values for Vout and Bridge Bias Current *
*
.param Ibias=126u
.param Vref=2.5
*
* Do not edit the below lines *
*
.param gm=110u ; transconductance in Siemens *
.param Rlower={Vref/Ibias}
.param Rupper={(Vout-Vref)/Ibias}
.param boost={PM-PS-90}
.param G={10**(-Gfc/20)}
.param kf={tan((boost/2+45)*pi/180)}
.param fp={fc*kf}
.param fz={fc/kf}
.param a={sqrt((fc**2/fp**2)+1)}
.param b={sqrt((fz**2/fc**2)+1)}
.param R2={(a/b)*(fp*G)*(Rlower+Rupper)/((fp-fz)*Rlower*gm)}
.param C1={1/(2*pi*R2*fz)}
.param C2={Rlower*gm*(b/a)/(2*pi*fp*G*(Rlower+Rupper))}
*
* The dc labels are the values of the components:
* pV --> pF
* nV --> nF
* kV --> kOhms
* This is variable off-time PFC. Run an .op statement to see
* the values automated by the macro.
* Christophe Basso - November 2024
.backanno
.end